# Altium project IncuNest.PrjPcb (part 2 of 2)

## Sheet Actuators.SchDoc: Actuators
size A3; SheetNumber: 5; SheetTotal: 10
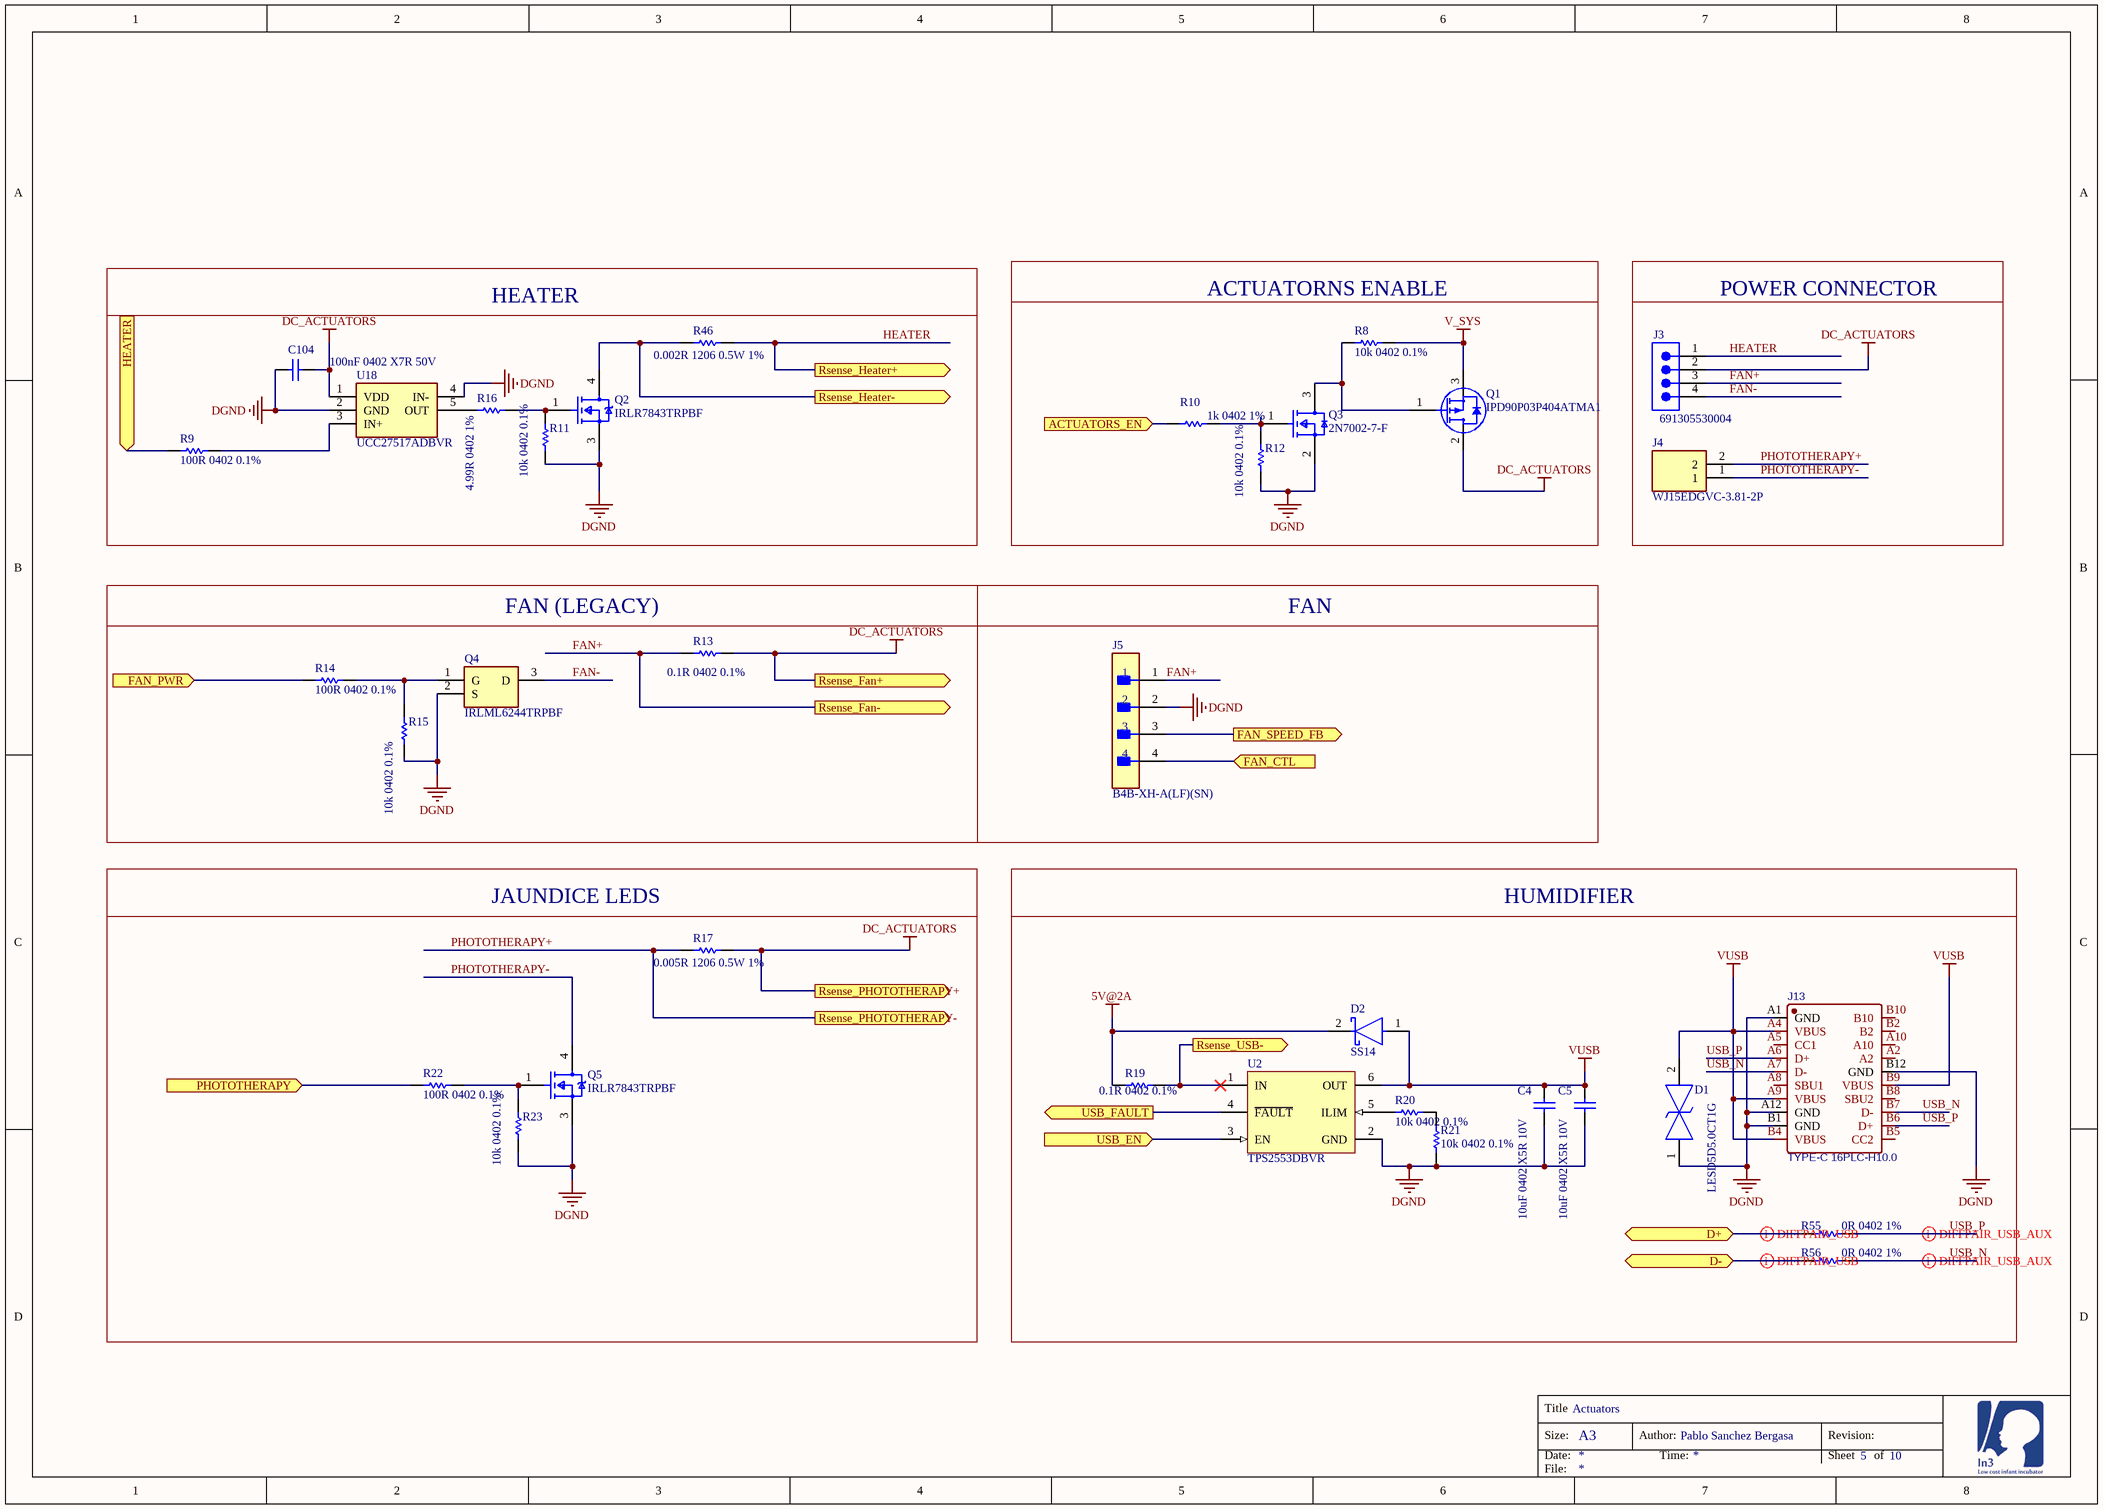
[diagram p6: Actuators.SchDoc]

### Parts
C4  10uF 0402 X5R 10V  [CAPC1005X55X25NL5T10]
C5  10uF 0402 X5R 10V  [CAPC1005X55X25NL5T10]
C104  100nF 0402 X7R 50V  [CAPC1005X55X25NL5T10]
D1  LESD5D5.0CT1G  [LESD5D50CT1G]
D2  SS14  [FP-403AE-MFG]
J3  691305530004  [691305530004]
J4  WJ15EDGVC-3.81-2P  [SHDR2W85P0X381_1X2_850X700X935P]
J5  B4B-XH-A(LF)(SN)  [FP-B4B-XH-A_LF_SN-MFG]
J13  TYPE-C 16PLC-H10.0  [TYPE-C-TH_16PLC-H10.0]
Q1  IPD90P03P404ATMA1  [DPAK IPD90P03P404ATMA1]
Q2  IRLR7843TRPBF  [FP-PG-TO252-3-MFG]
Q3  2N7002-7-F  [FP-SOT23-MFG]
Q4  IRLML6244TRPBF  [SOT95P237X112-3N]
Q5  IRLR7843TRPBF  [FP-PG-TO252-3-MFG]
R8  10k 0402 0.1%  [RESC1005X40X25ML05T10]
R9  100R 0402 0.1%  [RESC1005X40X25ML05T10]
R10  1k 0402 1%  [RESC1005X40X25ML05T10]
R11  10k 0402 0.1%  [RESC1005X40X25ML05T10]
R12  10k 0402 0.1%  [RESC1005X40X25ML05T10]
R13  0.1R 0402 0.1%  [RESC1005X40X25ML05T10]
R14  100R 0402 0.1%  [RESC1005X40X25ML05T10]
R15  10k 0402 0.1%  [RESC1005X40X25ML05T10]
R16  4.99R 0402 1%  [RESC1005X40X25ML05T10]
R17  0.005R 1206 0.5W 1%  [CAPC3216X180X55ML20T25]
R19  0.1R 0402 0.1%  [RESC1005X40X25ML05T10]
R20  10k 0402 0.1%  [RESC1005X40X25ML05T10]
R21  10k 0402 0.1%  [RESC1005X40X25ML05T10]
R22  100R 0402 0.1%  [RESC1005X40X25ML05T10]
R23  10k 0402 0.1%  [RESC1005X40X25ML05T10]
R46  0.002R 1206 0.5W 1%  [CAPC3216X180X55ML20T25]
R55  0R 0402 1%  [RESC1005X40X25ML05T10]
R56  0R 0402 1%  [RESC1005X40X25ML05T10]
U2  TPS2553DBVR  [DBV0006A_M]
U18  UCC27517ADBVR  [SOT95P280X145-5N]

### Blocks framed on the sheet
HEATER: C104 Q2 R9 R11 R16 R46 U18
ACTUATORNS ENABLE: Q1 Q3 R8 R10 R12
POWER CONNECTOR: J3 J4
FAN: J5
FAN (LEGACY): Q4 R13-R15
JAUNDICE LEDS: Q5 R17 R22 R23
HUMIDIFIER: C4 C5 D1 D2 J13 R19-R21 R55 R56 U2

### Ports
ACTUATORS_EN (in), D+ (bidir), D- (bidir), FAN_CTL (in), FAN_PWR (in), FAN_SPEED_FB (out), HEATER (in), PHOTOTHERAPY (in), Rsense_Fan+ (out), Rsense_Fan- (out), Rsense_Heater+ (out), Rsense_Heater- (out), Rsense_PHOTOTHERAPY+ (out), Rsense_PHOTOTHERAPY- (out), Rsense_USB- (out), USB_EN (in), USB_FAULT (out)

### Nets
5V@2A: D2.2(C) R19.1
DC_ACTUATORS: C104.1 J3.2 Q1.2(D) R13.2 R17.1 U18.1(VDD) ; port Rsense_PHOTOTHERAPY+, port Rsense_Fan+
DGND: C4.1 C5.1 C104.2 D1.1 J5.2 J13.A1(GND) J13.A12(GND) J13.B1(GND) J13.B12(GND) Q2.3(SOURCE) Q3.2(S) Q4.2(S) Q5.3(SOURCE) R11.1 R12.1 R15.1 R21.1 R23.1 U2.2(GND) U18.2(GND) U18.4(IN-)
V_SYS: Q1.3(S) R8.1
VUSB: C4.2 C5.2 D1.2 D2.1(A) J13.A4(VBUS) J13.A9(VBUS) J13.B4(VBUS) J13.B9(VBUS) U2.6(OUT)
D_N: R56.2 ; port D-
D_P: R55.2 ; port D+
FAN+: J3.3 J5.1 R13.1 ; port Rsense_Fan-
FAN-: J3.4 Q4.3(D)
HEATER: J3.1 R46.1 ; port Rsense_Heater+
PHOTOTHERAPY+: J4.2 R17.2 ; port Rsense_PHOTOTHERAPY-
PHOTOTHERAPY-: J4.1 Q5.4(DRAIN)
USB_N: J13.A7(D-) J13.B7(D-) R56.1
USB_P: J13.A6(D+) J13.B6(D+) R55.1
NetJ5_3: J5.3 ; port FAN_SPEED_FB
NetJ5_4: J5.4 ; port FAN_CTL
NetQ1_1: Q1.1(G) Q3.3(D) R8.2
NetQ2_1: Q2.1(GATE) R11.2 R16.1
NetQ2_4: Q2.4(DRAIN) R46.2 ; port Rsense_Heater-
NetQ3_1: Q3.1(G) R10.1 R12.2
NetQ4_1: Q4.1(G) R14.2 R15.2
NetQ5_1: Q5.1(GATE) R22.2 R23.2
NetR3_2: R9.1 ; port HEATER
NetR9_2: R9.2 U18.3(IN+)
NetR10_2: R10.2 ; port ACTUATORS_EN
NetR14_1: R14.1 ; port FAN_PWR
NetR16_2: R16.2 U18.5(OUT)
NetR19_2: R19.2 U2.1(IN) ; port Rsense_USB-
NetR20_1: R20.1 R21.2
NetR20_2: R20.2 U2.5(ILIM)
NetR22_1: R22.1 ; port PHOTOTHERAPY
NetU1_5: U2.3(EN) ; port USB_EN
NetU1_6: U2.4(~{FAULT}) ; port USB_FAULT

Not connected (* = marked no-connect by the designer): J13 A2 A5(CC1) A8(SBU1) A10 B2 B5(CC2) B8(SBU2) B10

### Layout directives
differential pair; differential pair class USB_AUX: USB_N, USB_P
differential pair; differential pair class USB: D_N, D_P

### Notes on the sheet
- Title
- Size:
- Date:
- A3
- Author:
- Time:
- Revision:
- Sheet
- of
- File:

### Library data of the parts
C4 C5 C104 = CMP-1662-00020-1: ComponentLink2Description: Datasheet; ComponentLink2URL: http://psearch.en.murata.com/capacitor/product/GRM155R60J105KE19%23.pdf; ComponentLink1Description: Manufacturer URL; ComponentLink1URL: http://www.murata.com/
  C4 C5: LCSC_PN: C77000
  C104: LCSC_PN: C77020
D1 = LESD5D5.0CT1G: TVS Diode (Bi-directional); Manufacturer_Name: LRC; Height: 0.7mm; Manufacturer_Part_Number: LESD5D5.0CT1G; LCSC_PN: C383211
D2 = CMP-2000-04943-2: DIODE SCHOTTKY 40V 1A SMA; Manufacturer: ON Semiconductor; Peak Reverse Current: 0.2mA; Max Junction Temp: +125°C; Standoff Height: 0.05mm; Max Surge Forward Current: 40A; Mouser Description: Schottky Diodes & Rectifiers SMA 40V 1.0A; RoHS: TRUE; Lead Free: Yes; Manufacturer Part Number: SS14; Device Class L3: Schottky Diodes; Category: Diode; Automotive: No; Digikey Description: DIODE SCHOTTKY 40V 1A SMA; ComponentLink2Description: Datasheet; Device Class L2: Diodes; Height: 2.5mm; Temperature Range High: +125°C; ComponentLink2URL: https://www.onsemi.com/pub/Collateral/SS19-D.PDF; Device Class L1: Discrete Semiconductors; Package: 403AE; Octopart: https://octopart.com/ss14-on+semiconductor-29205033; Max Repetitive Reverse Voltage: 40V; Temperature Range Low: -65°C; Forward Current: 1A; Temperature: -65°C to +125°C; LCSC_PN: C2480
J3 = CMP-03913-99613968-2: Terminal Block PCB Header with Plastic Latches, Through Hole, 5.08mm Pitch, Straight, 4 Poles; LCSC_PN: C441388
J4 = WJ15EDGVC-3.81-2P: Connector; Manufacturer_Name: Ningbo Kangnex; Datasheet Link: https://datasheet.lcsc.com/szlcsc/Ningbo-Kangnex-Elec-WJ15EDGVC-3-81-2P_C8396.pdf; Height: 9.35mm; Manufacturer_Part_Number: WJ15EDGVC-3.81-2P; LCSC_PN: C22365241
J5 = CMP-17439-000250-1: CONN HEADER VERT 4POS 2.5MM; Number of Contacts: 4; Contact Resistance: 20mR; Voltage Rating: 250V; Max Current Rating: 3A; Gender: Male; Wire/Cable Gauge: 22AWG; Mated Stacking Heights: 9.8mm; Insulation Resistance: 1GR; Orientation: Straight; Contact Type: Male Pin; Contact Finish - Mating: TIN; Series: XH; Max Voltage Rating (AC): 250V; Lead Pitch: 2.5mm; Contact Shape: Square; Insulation Color: Natural; Termination: Solder; Lead Free: Lead Free; Voltage Rating (AC): 250V; Number of Rows: 1; Flammability Rating: UL94 V-0; Number of Positions: 4; Max Operating Temperature: 85°C; Package Quantity: 500; Mount: Through Hole; REACH SVHC: No SVHC; Connector Type: Header; Insulation Material: Nylon; Fastening Type: Detent; Min Operating Temperature: -25°C; Housing Color: White; Packaging: Bulk; Contact Plating: Tin; Contact Material: Brass; Max Voltage Rating (DC): 250V; Housing Material: Polyamide; Color: Natural; Material: Polyamide; Pitch: 2.5mm; Depth: 5.75mm; Current Rating: 3A; Length: 12.4mm; LCSC_PN: C144395
J13 = TYPE-C 16PLC-H10.0: Manufacturer: SHOU HAN(首韩); Contributor: lcsc; Supplier: LCSC; Supplier Part: C3151747; Manufacturer Part: TYPE-C 16PLC-H10.0; JLCPCB Part Class: Extended Part; spicePre: U; spiceSymbolName: TYPE-C 16PLC-H10.0; LCSC_PN: C3151747
Q1 = CMP-3103264-6: Single P-Channel 30 V 4.5 mOhm 100 nC OptiMOS Power Mosfet - TO-252-3-11; Lead-Free Status: Lead Free; REACH SVHC Compliance: No SVHC; Octopart URL: https://octopart.com/ipd90p03p404atma1-infineon-21386769; Polarity: P-Channel; RoHS: Compliant; Mounting Style: Surface Mount; Operating Temperature: 175 °C (max); Packaging: Reel; Number of Pins: 3; OctopartID: f6ad3ee185da296a; Manufacturer Part Number: IPD90P03P404ATMA1; Manufacturer Part Number 2: WSF70P03; LCSC_PN: C845609
Q2 Q5 = CMP-32901-000143-1: MOSFET N-CH 30V 161A DPAK; Manufacturer: Infineon; Drain To Source Resistance: 3.2mΩ; Depletion Mode: False; Reverse Recovery Time: 39ns; Reverse Recovery Charge: 36nC; Threshold Vgs Max: 2.3V; Rthja Max: 50°C/W; Threshold Vgs Min: 1.4V; Power Dissipation: 140W; Pulse Drain Current: 620A; Input Capacitace At Vds: 4380pF @ 15V; Turn On Delay Time: 25ns; Gate To Source Voltage: 20V; Max Forward Diode Voltage: 1V; Gate Charge At Vgs: 34nC @ 4.5V; Max Junction Temp: +175°C; Number Of Channels: 1; Turn Off Delay Time: 34ns; ComponentLink2URL: https://www.infineon.com/dgdl/irlr7843pbf.pdf?fileId=5546d462533600a40153566de53526d8; Temperature Range High: +175°C; Octopart: https://octopart.com/irlr7843trpbf-infineon-65875062; Temperature: -55°C to +175°C; Device Class L3: MOSFETs; Manufacturer Part Number: IRLR7843TRPBF; Category: Trans; Package: PG-TO252-3; Footprint Url: https://www.infineon.com/cms/en/product/packages/PG-TO252/PG-TO252-3-901/; Continuous Drain Current: 161A; Digikey Description: MOSFET N-CH 30V 161A DPAK; Automotive: No; Lead Free: Yes; Drain To Source Breakdown Voltage: 30V; Height: 2.52mm; Temperature Range Low: -55°C; RoHS: TRUE; Number Of N Channels: 1; Drain To Source Voltage: 30V; ComponentLink2Description: Datasheet; Device Class L2: Transistors; Device Class L1: Discrete Semiconductors; LCSC_PN: C21988
Q3 = CMP-2000-04929-2: MOSFET N-CH 60V 115MA SOT23-3; Turn-On Delay Time: 7ns; Turn-Off Delay Time: 11ns; Drain to Source Resistance: 7.5R; Rise Time: 3ns; Drain to Source Breakdown Voltage: 70V; Input Capacitance: 50pF; Number of Elements: 1; Power Dissipation: 540mW; Max Power Dissipation: 300mW; Fall Time: 5.6ns; Gate to Source Voltage (Vgs): 20V; Threshold Voltage: 2.5V; Element Configuration: Single; Termination: SMD/SMT; Weight: 0.000282oz; Radiation Hardening: No; Max Operating Temperature: 150°C; On-State Resistance: 7.5R; Mount: Surface Mount; Current Rating: 115mA; Contact Plating: Tin; Lead Free: Lead Free; Min Operating Temperature: -55°C; Number of Pins: 3; REACH SVHC: No SVHC; Drain to Source Voltage (Vdss): 60V; Width: 1.3mm; Package Quantity: 3000; Length: 2.9mm; Case/Package: SOT-23; Number of Channels: 1; Dual Supply Voltage: 60V; Packaging: Tape and Reel; Height: 1mm; Voltage Rating (DC): 60V; Nominal Vgs: 2.5V; Continuous Drain Current (ID): 115mA; Voltage: 60V; Rds On Max: 7.5R; LCSC_PN: C65189
Q4 = IRLML6244TRPBF: Transistor; Manufacturer_Name: Infineon; Datasheet Link: http://www.infineon.com/dgdl/irlml6244pbf.pdf?fileId=5546d462533600a4015356686fed261f; Height: 1.12mm; Manufacturer_Part_Number: IRLML6244TRPBF; Mouser Part Number: 942-IRLML6244TRPBF; Mouser Price/Stock: https://www.mouser.co.uk/ProductDetail/Infineon-IR/IRLML6244TRPBF?qs=9%252BKlkBgLFf1HkY%2F2U%252BIhLQ%3D%3D; Arrow Part Number: IRLML6244TRPBF; Arrow Price/Stock: https://www.arrow.com/en/products/irlml6244trpbf/infineon-technologies-ag?region=nac; LCSC_PN: C143946
R8-R16 R19-R23 R55 R56 = CMP-2002-07472-1
  R8 R11 R12 R15 R20 R21 R23: LCSC_PN: C190095
  R9 R14 R22: LCSC_PN: C106233
  R10: LCSC_PN: C106235
  R13 R19: LCSC_PN: C2139031
  R16: LCSC_PN: C844114
  R55 R56: LCSC_PN: C60485
R17 = CMP-0abdc173b10ad57a-1: Manufacturer Part Number: WSLP12065L000FEA; Resistance: 0,024; Power: 1W; Octopart URL: https://octopart.com/1-2176055-0-te+connectivity-46440145; Case/Package: 1206; Lifecycle Status: Not Listed by Manufacturer; Packaging: Tape & Reel (TR); OctopartID: 0abdc173b10ad57a; OrderingCode: WSLP12065L000FEA; Manufacturer Part Number 2: FMF06FTHR005-LHL; LCSC_PN: C728276
R46 = CMP-0abdc173b10ad57a-1: 0.005R 1206 0.5W 1%; Manufacturer Part Number: WSLP12065L000FEA; Resistance: 0,024; Power: 1W; Octopart URL: https://octopart.com/1-2176055-0-te+connectivity-46440145; Case/Package: 1206; Lifecycle Status: Not Listed by Manufacturer; Packaging: Tape & Reel (TR); OctopartID: 0abdc173b10ad57a; OrderingCode: WSLP12065L000FEA; Manufacturer Part Number 2: FMF06FTHR005-LHL; LCSC_PN: C728282
U2 = CMP-0337-00284-2: Adjustable, Active High, Constant-Current, Current-Limited Power-Distribution Switch, 0.075 to 1.7 A Current Limit, -40 to 85 degC, 6-pin SOT-23 (DBV), Green (RoHS & no Sb/Br); Manufacturer: Texas Instruments; Continuous Current(Max)(A): 1.5; Vin(Min)(V): 2.5; Current Limit Accuracy @ 1A: +/-7.5% (925mA min / 1075mA max); Vin(Max)(V): 6.5; Rating: Catalog; rDS(on) per FET(Typ)(mOhms): 100/DRV, 85/DBV; Number of Switches: 1; ComponentLink1Description: Datasheet; PartNumber: TPS2553DBVR; Enable: Active High; PackageDescription: 6-Pin Plastic Small-Outline Package, 2.9 x 1.6 mm Body, 0.95 mm Pitch, 2.8 mm Lead Span; DatasheetVersion: SLVS841E; Code_JEDEC: MO-178-AB*; Current Limit Topology: Constant-Current; Mounting Technology: Surface Mount; Eco-Plan: Green (RoHS & no Sb/Br); PackageVersion: revK, Mar-2006; PackageReference: DBV0006A; ComponentLink1URL: http://www.ti.com/general/docs/lit/getliterature.tsp?genericPartNumber=TPS2553&fileType=pdf; Current Limit(A): 0.075 to 1.7; LCSC_PN: C55266
U18 = UCC27517ADBVR: Integrated Circuit; Manufacturer_Name: Texas Instruments; Datasheet Link: http://www.ti.com/lit/gpn/ucc27517a; Height: 1.45mm; Manufacturer_Part_Number: UCC27517ADBVR; Mouser Part Number: 595-UCC27517ADBVR; Mouser Price/Stock: https://www.mouser.co.uk/ProductDetail/Texas-Instruments/UCC27517ADBVR?qs=e5T%2FzGlhGOZhJZidb%252B7EgQ%3D%3D; Arrow Part Number: UCC27517ADBVR; Arrow Price/Stock: https://www.arrow.com/en/products/ucc27517adbvr/texas-instruments.html?utm_currency=USD&region=nac; LCSC_PN: C2653784

## Sheet Buzzer.SchDoc: Buzzer
size A4; SheetNumber: 7; SheetTotal: 10
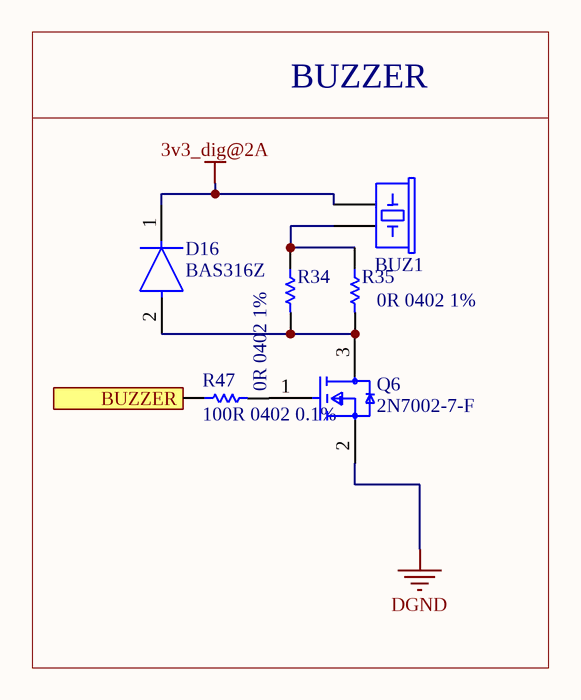
[diagram p7: Buzzer.SchDoc]

### Parts
BUZ1  CUI CMT-1285C-035  [BUZZER-12MM-NS]  (value not drawn)
D16  BAS316Z  [FP-SOD323-IPC_B]
Q6  2N7002-7-F  [FP-SOT23-MFG]
R34  0R 0402 1%  [RESC1005X40X25ML05T10]
R35  0R 0402 1%  [RESC1005X40X25ML05T10]
R47  100R 0402 0.1%  [RESC1005X40X25ML05T10]

### Blocks framed on the sheet
BUZZER: BUZ1 D16 Q6 R34 R35 R47

### Ports
BUZZER (in)

### Nets
3v3_dig@2A: BUZ1.1(+) D16.1(C)
DGND: Q6.2(S)
NetBUZ1_2: BUZ1.2(-) R34.1 R35.1
NetD16_2: D16.2(A) Q6.3(D) R34.2 R35.2
NetQ6_1: Q6.1(G) R47.2
NetR47_1: R47.1 ; port BUZZER

### Notes on the sheet
- Title
- Size:
- Date:
- A3
- Author:
- Time:
- Revision:
- Sheet
- of
- File:

### Library data of the parts
BUZ1 = CMP-581a9557be5887dd-1: Audio Buzzer Magnetic 3Vo-p 5Vo-p 70mA 3.5Vo-p 85dB Through Hole Pin Tray; Lead-Free Status: Lead Free; Octopart URL: https://octopart.com/cmt-1285c-035-cui-71811876; Manufacturer Part Number: CMT-1285C-035; Mounting Style: Through Hole; RoHS: Compliant; OctopartID: 581a9557be5887dd; Manufacturer Part Number 2: GMC1205YA-16R2048; LCSC_PN: C252915
D16 = CMP-14399-000022-1: DIODE GEN PURP 100V 250MA SC76-2; RoHS Compliant: Yes; LCSC_PN: C549222
Q6 = CMP-2000-04929-2: as Q3 on sheet Actuators; Termination: SMD/SMT; Weight: 0.000282oz; Radiation Hardening: No; Max Operating Temperature: 150°C; On-State Resistance: 7.5R; Mount: Surface Mount; Current Rating: 115mA; Contact Plating: Tin; Lead Free: Lead Free; Min Operating Temperature: -55°C; Number of Pins: 3; REACH SVHC: No SVHC; Drain to Source Voltage (Vdss): 60V; Width: 1.3mm; Package Quantity: 3000; Length: 2.9mm; Case/Package: SOT-23; Number of Channels: 1; Dual Supply Voltage: 60V; Packaging: Tape and Reel; Height: 1mm; Voltage Rating (DC): 60V; Nominal Vgs: 2.5V; Continuous Drain Current (ID): 115mA; Voltage: 60V; Rds On Max: 7.5R; LCSC_PN: C65189
R34 R35 R47 = CMP-2002-07472-1
  R34 R35: LCSC_PN: C60485
  R47: LCSC_PN: C106233

## Sheet AFE.SchDoc
size A3; SheetNumber: 6; SheetTotal: 10
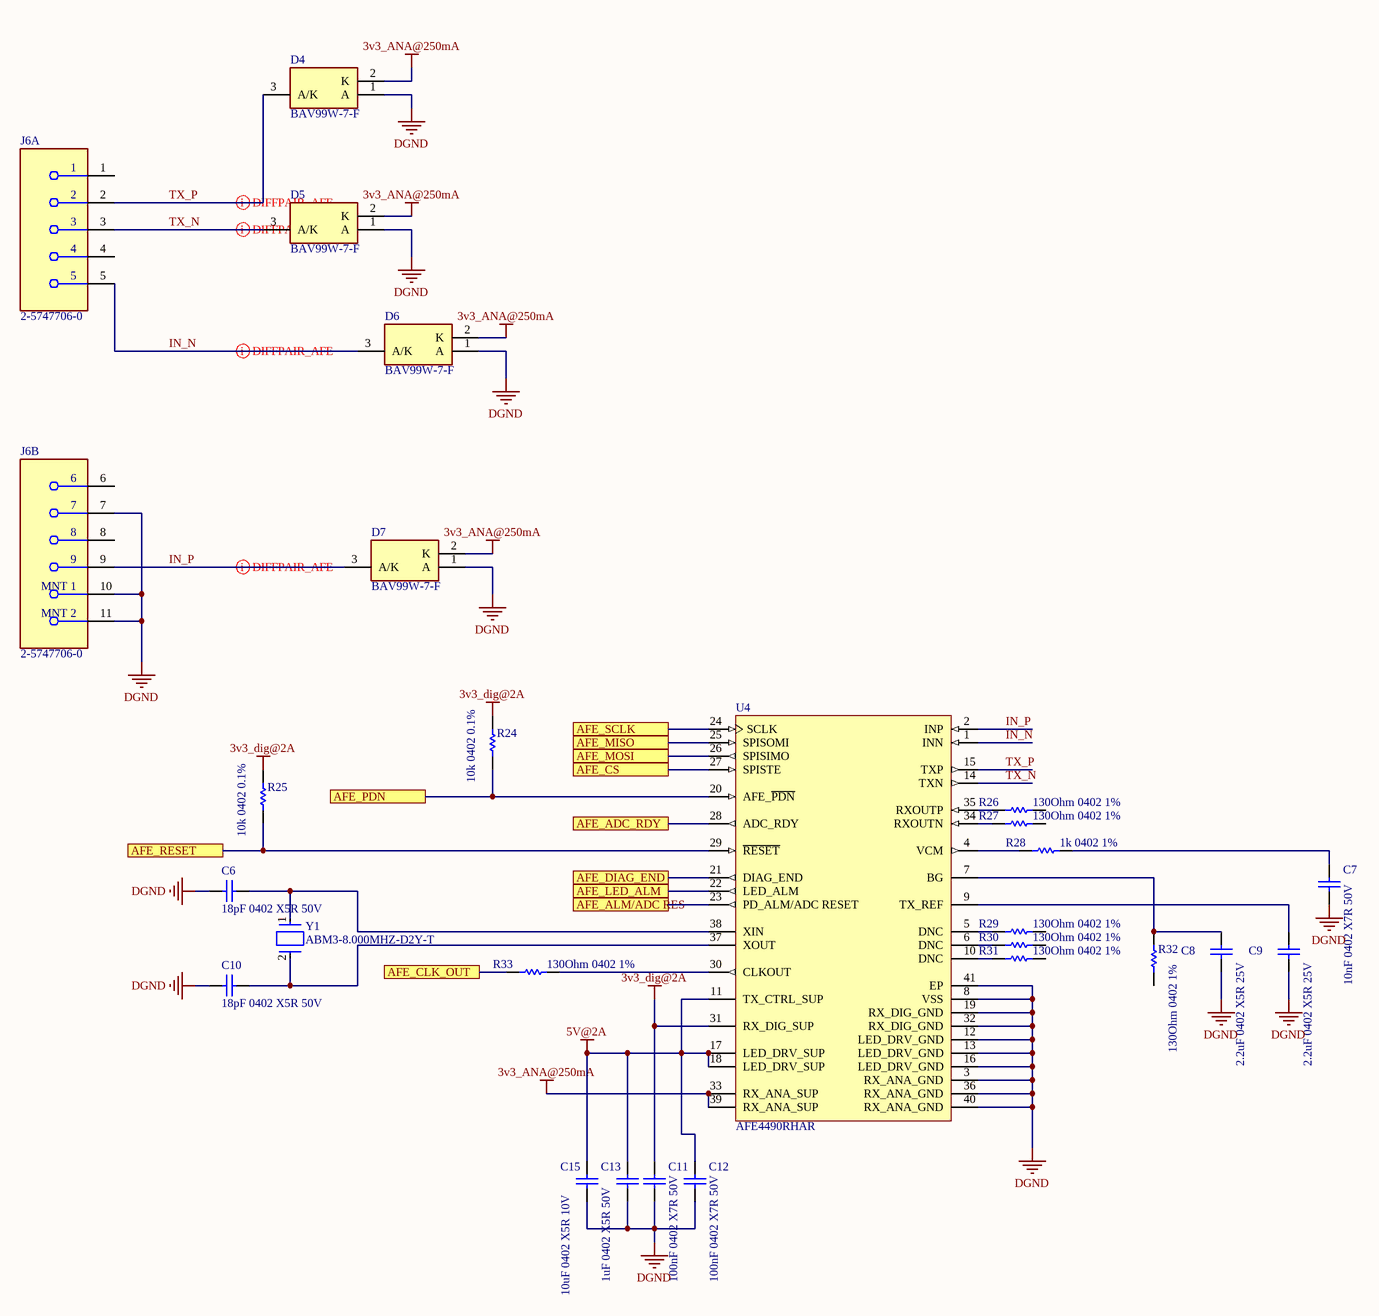
[diagram p8: AFE.SchDoc]

### Parts
C6  18pF 0402 X5R 50V  [CAPC1005X55X25NL5T10]
C7  10nF 0402 X7R 50V  [CAPC1005X55X25NL5T10]
C8  2.2uF 0402 X5R 25V  [CAPC1005X55X25NL5T10]
C9  2.2uF 0402 X5R 25V  [CAPC1005X55X25NL5T10]
C10  18pF 0402 X5R 50V  [CAPC1005X55X25NL5T10]
C11  100nF 0402 X7R 50V  [CAPC1005X55X25NL5T10]
C12  100nF 0402 X7R 50V  [CAPC1005X55X25NL5T10]
C13  1uF 0402 X5R 50V  [CAPC1005X55X25NL5T10]
C15  10uF 0402 X5R 10V  [CAPC1005X55X25NL5T10]
D4  BAV99W-7-F  [SOT65P210X110-3N]
D5  BAV99W-7-F  [SOT65P210X110-3N]
D6  BAV99W-7-F  [SOT65P210X110-3N]
D7  BAV99W-7-F  [SOT65P210X110-3N]
J6  2-5747706-0  [FP-2-5747706-0-MFG]  (parts A,B of 2)
R24  10k 0402 0.1%  [RESC1005X40X25ML05T10]
R25  10k 0402 0.1%  [RESC1005X40X25ML05T10]
R26  130Ohm 0402 1%  [RESC1005X40X25ML05T10]
R27  130Ohm 0402 1%  [RESC1005X40X25ML05T10]
R28  1k 0402 1%  [RESC1005X40X25ML05T10]
R29  130Ohm 0402 1%  [RESC1005X40X25ML05T10]
R30  130Ohm 0402 1%  [RESC1005X40X25ML05T10]
R31  130Ohm 0402 1%  [RESC1005X40X25ML05T10]
R32  130Ohm 0402 1%  [RESC1005X40X25ML05T10]
R33  130Ohm 0402 1%  [RESC1005X40X25ML05T10]
U4  AFE4490RHAR  [RHA0040B_V]
Y1  ABM3-8.000MHZ-D2Y-T  [FP-ABM3-MFG]

### Ports
AFE_ADC_RDY, AFE_ALM/ADC RES, AFE_CLK_OUT, AFE_CS, AFE_DIAG_END, AFE_LED_ALM, AFE_MISO, AFE_MOSI, AFE_PDN, AFE_RESET, AFE_SCLK

### Nets
3v3_ANA@250mA: D4.2(K) D5.2(K) D6.2(K) D7.2(K) U4.33(RX_ANA_SUP) U4.39(RX_ANA_SUP)
3v3_dig@2A: C11.2 R24.2 R25.2 U4.31(RX_DIG_SUP)
5V@2A: C12.2 C13.2 C15.2 U4.11(TX_CTRL_SUP) U4.17(LED_DRV_SUP) U4.18(LED_DRV_SUP)
DGND: C6.1 C7.1 C8.1 C9.1 C10.1 C11.1 C12.1 C13.1 C15.1 D4.1(A) D5.1(A) D6.1(A) D7.1(A) J6.7 J6.10(MNT_1) J6.11(MNT_2) U4.3(RX_ANA_GND) U4.8(VSS) U4.12(LED_DRV_GND) U4.13(LED_DRV_GND) U4.16(LED_DRV_GND) U4.19(RX_DIG_GND) U4.32(RX_DIG_GND) U4.36(RX_ANA_GND) U4.40(RX_ANA_GND) U4.41(EP)
AFE_CS: U4.27(SPISTE) ; port AFE_CS
AFE_LED_ALM: U4.22(LED_ALM) ; port AFE_LED_ALM
AFE_READY: U4.28(ADC_RDY) ; port AFE_ADC_RDY
IN_N: D6.3(A/K) J6.5 U4.1(INN)
IN_P: D7.3(A/K) J6.9 U4.2(INP)
SPI_MISO: U4.25(SPISOMI) ; port AFE_MISO
SPI_MOSI: U4.26(SPISIMO) ; port AFE_MOSI
SPI_SCK: U4.24(SCLK) ; port AFE_SCLK
TX_N: D5.3(A/K) J6.3 U4.14(TXN)
TX_P: D4.3(A/K) J6.2 U4.15(TXP)
NetC6_2: C6.2 U4.38(XIN) Y1.1
NetC7_2: C7.2 R28.1
NetC8_2: C8.2 R32.2 U4.7(BG)
NetC9_2: C9.2 U4.9(TX_REF)
NetC10_2: C10.2 U4.37(XOUT) Y1.2
NetR24_1: R24.1 U4.20(AFE_~{PDN}) ; port AFE_PDN
NetR25_1: R25.1 U4.29(~{RESET}) ; port AFE_RESET
NetR26_2: R26.2 U4.35(RXOUTP)
NetR27_2: R27.2 U4.34(RXOUTN)
NetR28_2: R28.2 U4.4(VCM)
NetR29_2: R29.2 U4.5(DNC)
NetR30_2: R30.2 U4.6(DNC)
NetR31_2: R31.2 U4.10(DNC)
NetR33_1: R33.1 U4.30(CLKOUT)
NetR33_2: R33.2 ; port AFE_CLK_OUT
NetU4_21: U4.21(DIAG_END) ; port AFE_DIAG_END
NetU4_23: U4.23(PD_ALM/ADC_RESET) ; port AFE_ALM/ADC RES

Not connected (* = marked no-connect by the designer): J6 1 4 6 8; R26 1; R27 1; R29 1; R30 1; R31 1; R32 1

### Layout directives
differential pair; differential pair class AFE: IN_N, IN_P, TX_N, TX_P

### Library data of the parts
C6-C13 C15 = CMP-1662-00020-1: ComponentLink2Description: Datasheet; ComponentLink2URL: http://psearch.en.murata.com/capacitor/product/GRM155R60J105KE19%23.pdf; ComponentLink1Description: Manufacturer URL; ComponentLink1URL: http://www.murata.com/
  C6 C10: LCSC_PN: C33149
  C7: LCSC_PN: C60133
  C8 C9: LCSC_PN: C77002
  C11 C12: LCSC_PN: C77020
  C13: LCSC_PN: C1518208
  C15: LCSC_PN: C77000
D4-D7 = BAV99W-7-F: Diode; Manufacturer_Name: Diodes Inc.; Datasheet Link: https://www.diodes.com/assets/Datasheets/ds30045.pdf; Height: 1.1mm; Manufacturer_Part_Number: BAV99W-7-F; Mouser Part Number: 621-BAV99W-F; Mouser Price/Stock: https://www.mouser.co.uk/ProductDetail/Diodes-Incorporated/BAV99W-7-F?qs=KrBKXozF1ElcNxS3QKF7wg%3D%3D; Arrow Part Number: BAV99W-7-F; Arrow Price/Stock: https://www.arrow.com/en/products/bav99w-7-f/diodes-incorporated?region=europe; LCSC_PN: C93035
J6 = CMP-03367-000004-1: CONN D-SUB RCPT 9POS VERT SOLDER; Manufacturer: TE Connectivity; Is Female: yes; Conn Orientation: Vertical; Current Rating: 6A; Shielding: true; Number Of Contacts: 9; Conn Gender: Female; Pitch: 2.74mm; RoHS: TRUE; Temperature: -55°C to +105°C; Package: 2-5747706-0; Category: Conn; Automotive: No; Device Class L3: unset; Octopart: https://octopart.com/2-5747706-0-te+connectivity-39499683; Lead Free: Yes; Contact Material: Gold,Nickel; Height: 0.494inch; Temperature Range High: +105°C; Device Class L1: Connectors; ComponentLink2Description: Datasheet; Mouser Description: D-Sub Standard Connectors RECP FRNT MTL SHL 9P retention inserts; ComponentLink2URL: https://www.te.com/commerce/DocumentDelivery/DDEController?Action=showdoc&DocId=Customer+Drawing%7F5747706%7FB%7Fpdf%7FEnglish%7FENG_CD_5747706_B.pdf%7F2-5747706-0; Digikey Description: CONN D-SUB RCPT 9POS VERT SOLDER; Temperature Range Low: -55°C; Manufacturer Part Number: 2-5747706-0; Device Class L2: D-Sub Connectors; LCSC_PN: C189689
R24-R33 = CMP-2002-07472-1
  R24 R25: LCSC_PN: C190095
  R26 R27 R29-R33: LCSC_PN: C413066
  R28: LCSC_PN: C106235
U4 = CMP-0767-00003-2: Integrated Analog Front End for Pulse Oximeter, 2 to 3.6 V Rx, 3 to 5.25 V Tx, -40 to 85 degC, 40-Pin VQFN (RHA), RoHS, Tape and Reel; Manufacturer: Texas Instruments; CMRR: 75 dB; Resolution: 22 Bits; Sample Rate (max): 1.3 KSPS; Packing: RHA0040B; # Input Channels: 1; ComponentLink3Description: Package Specification; ComponentLink2Description: Datasheet; RoHS: TRUE; ComponentLink2URL: http://www.ti.com/lit/ds/symlink/afe4490.pdf; ComponentLink1Description: Manufacturer URL; DatasheetVersion: SBAS602F; AFE Digital Supply: 2 to 3.6 V; ComponentLink1URL: http://www.ti.com/; PartNumber: AFE4490RHAR; PackageVersion: 4204276/E; Operating Temperature Range: -40 to 85 degC; PackageReference: RHA-40; PackageDescription: 40-Pin Plastic Quad Flatpack No-Lead, Body 6 x 6 mm, Pitch 0.5 mm; Transmit Controller Supply: 3 to 5.25 V; ComponentLink3URL: http://www.ti.com.cn/cn/lit/ml/mpqf135c/mpqf135c.pdf; AFE Analog Supply: 2 to 3.6 V; Mounting Technology: Surface Mount; LCSC_PN: C2651608
Y1 = CMP-2000-05033-2: Crystal 8MHz ±20ppm 18pF SMD-2 5mm x 3.2mm; Series Resistance: 500R; Frequency Stability: 30ppm; ESR (Equivalent Series Resistance): 140R; Load Capacitance: 18pF; Height: 0.051inch; Tolerance: 20ppm; Depth: 3.2mm; Max Operating Temperature: 85°C; Frequency: 8MHz; Termination: SMD/SMT; Lead Free: Lead Free; Number of Pins: 2; Width: 3.2mm; RoHS Compliant: Yes; Resistor Type: Ceramic; Length: 5mm; Mount: Surface Mount; Case/Package: CSMD; Package Quantity: 1000; Radiation Hardening: No; Min Operating Temperature: -40°C; Packaging: Tape and Reel; Frequency Tolerance: 20ppm; LCSC_PN: C144380

## Sheet Display.SchDoc: GSM
size A4; SheetNumber: 10; SheetTotal: 10
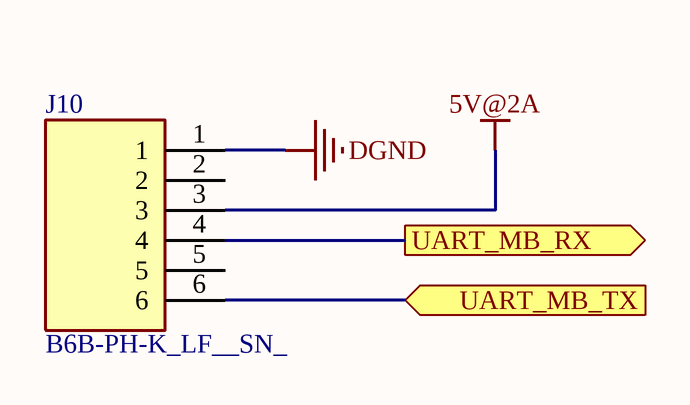
[diagram p9: Display.SchDoc]

### Parts
J10  B6B-PH-K_LF__SN_  [SHDR6W50P0X200_1X6_1390X450X600P]

### Ports
UART_MB_RX (out), UART_MB_TX (in)

### Nets
5V@2A: J10.3
DGND: J10.1
NetJ10_4: J10.4 ; port UART_MB_RX
NetJ10_6: J10.6 ; port UART_MB_TX

Not connected (* = marked no-connect by the designer): J10 2 5

### Notes on the sheet
- Title
- Size:
- Date:
- A3
- Author:
- Time:
- Revision:
- Sheet
- of
- File:

### Library data of the parts
J10 = B6B-PH-K_LF__SN_: Connector; Manufacturer_Name: JST (JAPAN SOLDERLESS TERMINALS); Manufacturer_Part_Number: B6B-PH-K(LF)(SN); Datasheet Link: https://www.jst-mfg.com/product/pdf/eng/ePH.pdf; Height: 6mm; Mouser Part Number: 306-B6BPHKLFSNP; Mouser Price/Stock: https://www.mouser.co.uk/ProductDetail/JST-Commercial/B6B-PH-KLFSN?qs=cdbOS8ANM9DNW35JVflPvg%3D%3D; LCSC_PN: C495261

## Nets that join several sheets
3v3_ANA@250mA: PowerManagement (C96.2 U15.5), Sensors (C26.2 U9.5), AFE (6 pins)
3v3_dig@2A: PowerManagement (7 pins), Sensors (5 pins), uC (9 pins), Buzzer (BUZ1.1 D16.1), AFE (C11.2 R24.2 R25.2 U4.31)
4V@2A: PowerManagement (7 pins), GSM (7 pins)
5V@2A: PowerManagement (9 pins), Sensors (6 pins), Actuators (D2.2 R19.1), AFE (6 pins), Display (J10.3)
DC_ACTUATORS: Sensors (U7.2 U7.15), Actuators (6 pins)
DGND: PowerManagement (37 pins), GSM (31 pins), Sensors (20 pins), uC (19 pins), PowerInput (60 pins), Actuators (21 pins), Buzzer (Q6.2), AFE (26 pins), Display (J10.1)
V_SYS: PowerManagement (15 pins), Sensors (U7.11), PowerInput (R49.1), Actuators (Q1.3 R8.1)
AFE_CS: uC (U1.23), AFE (U4.27)
AFE_LED_ALM: uC (U1.7), AFE (U4.22)
AFE_READY: uC (U1.10), AFE (U4.28)
BABY_TEMP: Sensors (R45.2 U9.1), uC (U1.12)
D_N: Sensors (J14.A7 J14.B7), uC (U1.13), Actuators (R56.2)
D_P: Sensors (J14.A6 J14.B6), uC (U1.14), Actuators (R55.2)
FAN+: Sensors (U7.1), Actuators (J3.3 J5.1 R13.1)
GSM_RX: GSM (R38.2), uC (U1.18)
GSM_TX: GSM (R36.2), uC (U1.17)
HEATER: Sensors (U8.12), Actuators (J3.1 R46.1)
NetD14_2: PowerManagement (D14.2), uC (U1.38)
NetJ5_3: uC (U1.31), Actuators (J5.3)
NetJ5_4: uC (U1.19), Actuators (J5.4)
NetJ10_4: uC (U1.9), Display (J10.4)
NetJ10_6: uC (U1.8), Display (J10.6)
NetQ2_4: Sensors (U8.11), Actuators (Q2.4 R46.2)
NetR3_2: uC (R3.2 U1.26), Actuators (R9.1)
NetR10_2: uC (U1.22), Actuators (R10.2)
NetR14_1: uC (U1.20), Actuators (R14.1)
NetR19_2: Sensors (U8.14), Actuators (R19.2 U2.1)
NetR22_1: uC (U1.21), Actuators (R22.1)
NetR47_1: uC (U1.39), Buzzer (R47.1)
NetR75_1: PowerManagement (R75.1), uC (U1.4)
NetR83_2: Sensors (R83.2), uC (U1.11)
NetU1_5: uC (U1.5), Actuators (U2.3)
NetU1_6: uC (U1.6), Actuators (U2.4)
PHOTOTHERAPY+: Sensors (U7.14), Actuators (J4.2 R17.2)
SCL: Sensors (U7.6 U8.6 U9.3), uC (R5.2 U1.25), PowerInput (U11.13)
SDA: Sensors (U7.7 U8.7 U9.4), uC (R6.2 U1.24), PowerInput (U11.12)
SPI_MISO: uC (U1.30), AFE (U4.25)
SPI_MOSI: uC (U1.28), AFE (U4.26)
SPI_SCK: uC (U1.29), AFE (U4.24)
Vsense+: Sensors (U7.12), PowerInput (11 pins)

## Assembly variants
Main: not fitted C9 C10 C13 C33 C51 C? J2 J2 J3 J5 J? L1 L2 L3 R3 R3 R7 R8 R9 R41 R46 R47 R48 R52 R56 R57 R58 R63 R81 R? R? R? R? R? R? RF_PCB1 SW1 U6 U8 U12 U13
NO_AFE: not fitted C9 C10 C13 C33 C54 C55 C56 C57 C58 C59 C60 C61 D28 D29 D31 D32 J14 R3 R58 R59 R60 R61 R62 R65 R66 R67 R68 R69 R71 R79 U17 Y1